# EAGLE schematic Speed Control Relays (EAGLE 6.5.0)
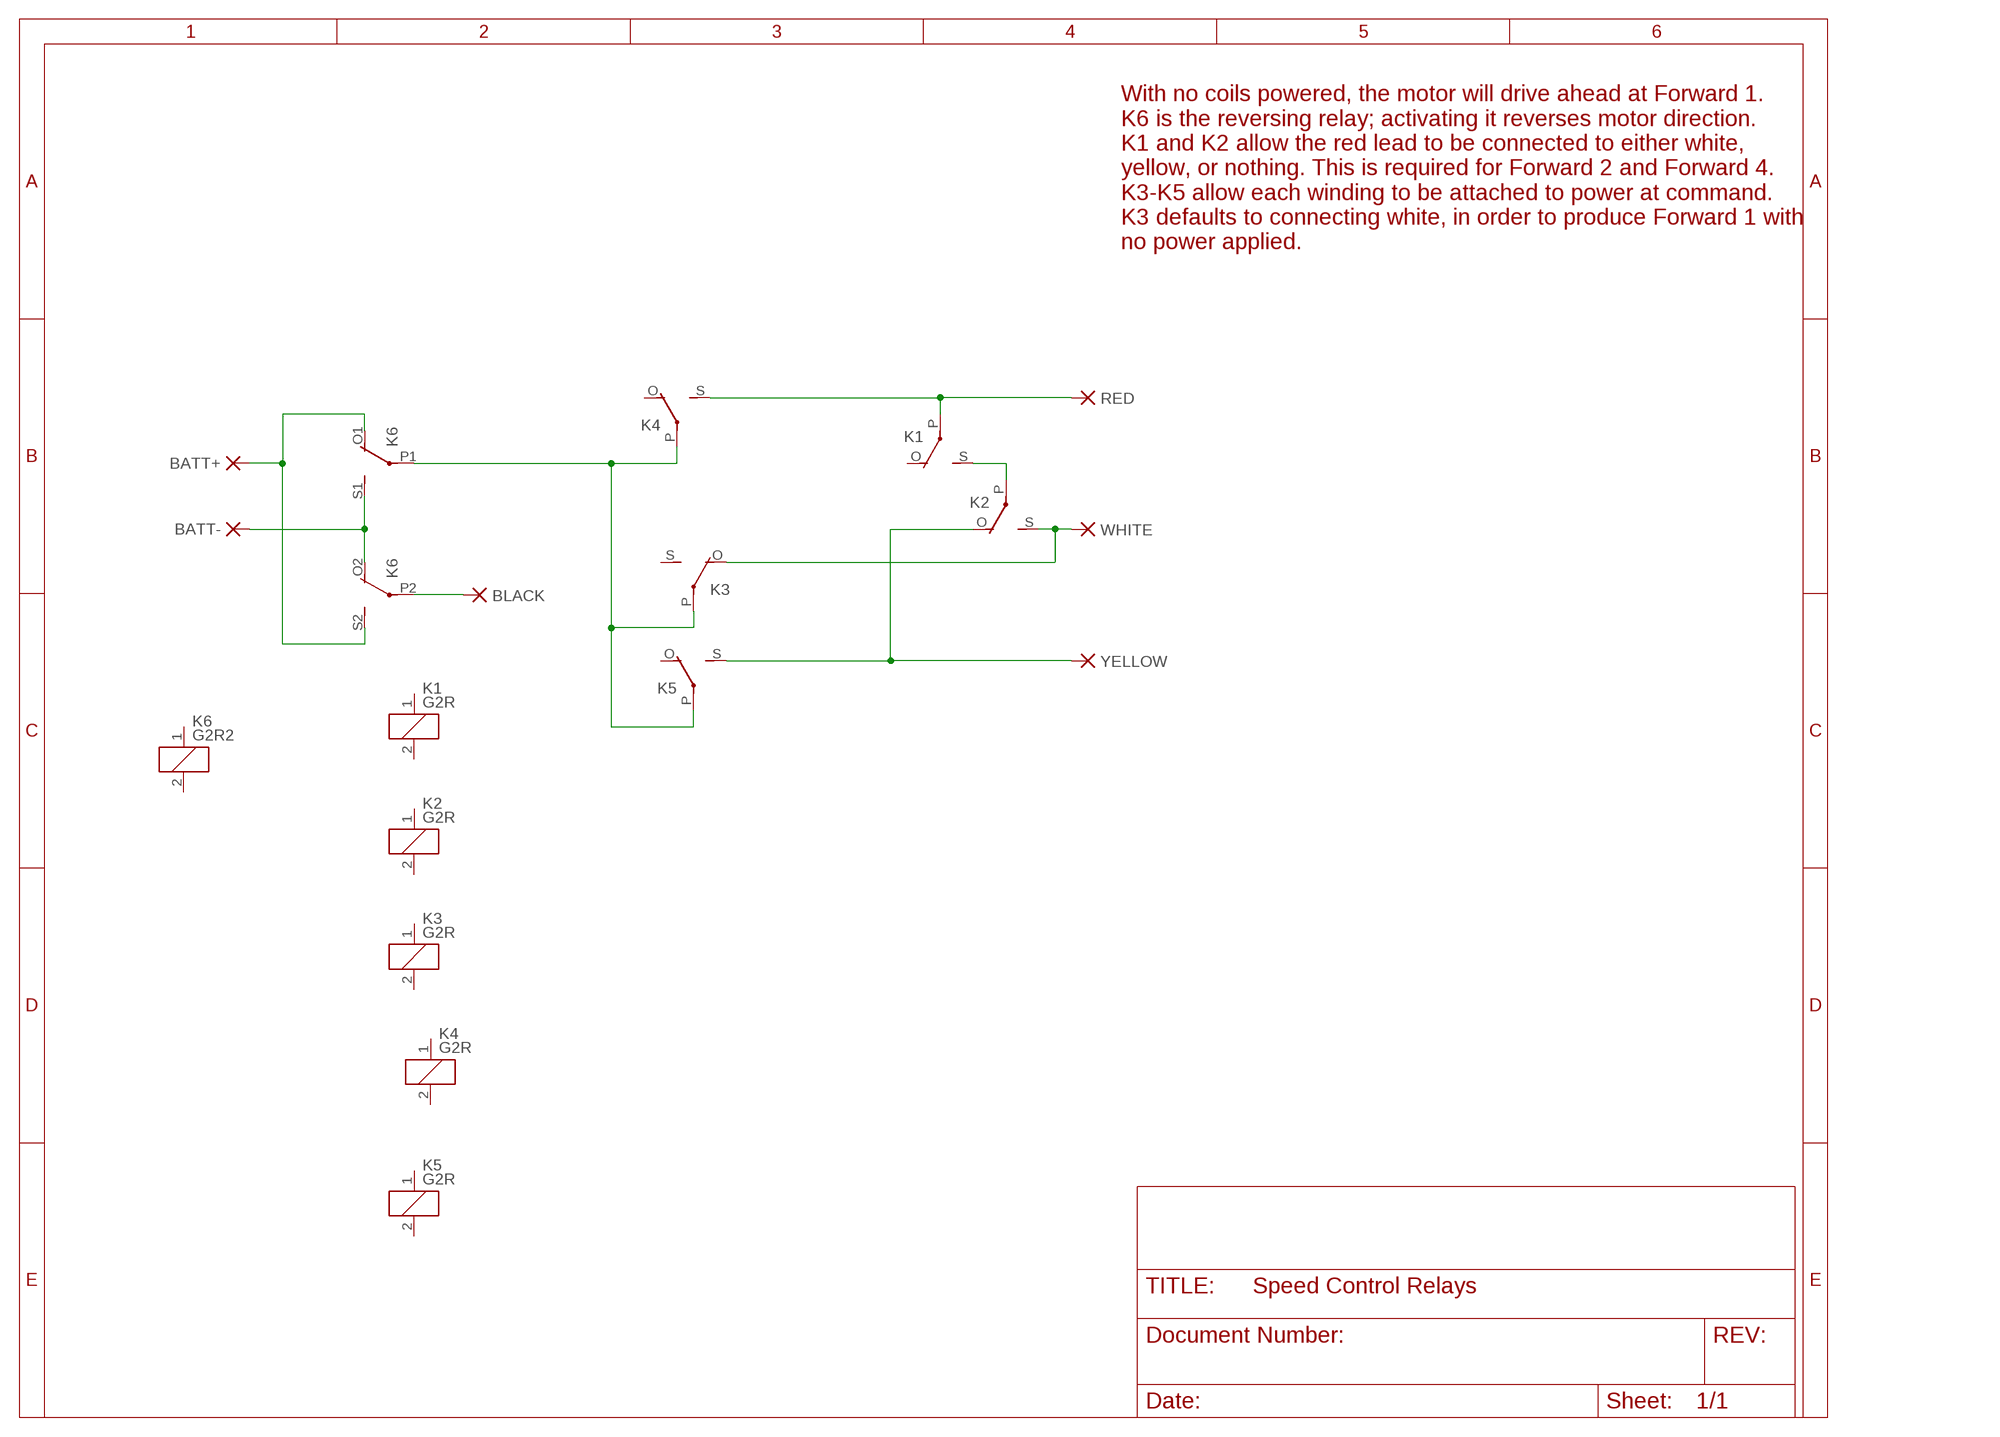
[diagram p0: schematic, sheet 1]

## Parts
BATT+  PAD-0240  [0240]
BATT-  PAD-0240  [0240]
BLACK  PAD-0240  [0240]
K1  G2R  [G2R]
K2  G2R  [G2R]
K3  G2R  [G2R]
K4  G2R  [G2R]
K5  G2R  [G2R]
K6  G2R2  [G2R2]
RED  PAD-0240  [0240]
WHITE  PAD-0240  [0240]
YELLOW  PAD-0240  [0240]

## Nets
N$1: BATT-.P$1(P) K6.O2(3:O) K6.S1(2:S)
N$2: BATT+.P$1(P) K6.O1(2:O) K6.S2(3:S)
N$3: BLACK.P$1(P) K6.P2(3:P)
N$4: K1.S(2:S) K2.P(2:P)
N$5: K1.P(2:P) K4.S(2:S) RED.P$1(P)
N$6: K2.O(2:O) K5.S(2:S) YELLOW.P$1(P)
N$7: K2.S(2:S) K3.O(2:O) WHITE.P$1(P)
N$8: K3.P(2:P) K4.P(2:P) K5.P(2:P) K6.P1(2:P)
Unconnected: K1.1 K1.2 K1.O(2:O) K2.1 K2.2 K3.1 K3.2 K3.S(2:S) K4.1 K4.2 K4.O(2:O) K5.1 K5.2 K5.O(2:O) K6.1 K6.2

## Notes on the sheet
- With no coils powered, the motor will drive ahead at Forward 1. 
  K6 is the reversing relay; activating it reverses motor direction.
  K1 and K2 allow the red lead to be connected to either white,
  yellow, or nothing. This is required for Forward 2 and Forward 4.
  K3-K5 allow each winding to be attached to power at command.
  K3 defaults to connecting white, in order to produce Forward 1 with
  no power applied.

## Library data of the parts
BATT+ BATT- BLACK RED WHITE YELLOW = logos-pads:PAD: WIRE PAD Standard US Drill Sizes and SMD pads
K1-K5 = relay:G2R: RELAY 1 x switch, Omron; OC_FARNELL: 1569185; OC_NEWARK: unknown
K6 = relay:G2R2: RELAY 2 x switch, Omron; MF: OMRON COMPONENTS USA; MPN: G2R-2-DC6; OC_FARNELL: unknown; OC_NEWARK: 89C5317